# Altium project FMC_AWG_Common.PrjPCB (part 2 of 5)

## Sheet FMC_AWG_DAC_PSU_LDO.SchDoc: FMC DAC 1.5GS 4CH
size 420 x 297 mm; Author: G.Kasprowicz; CompanyName: WUT ISE; DrawnBy: G.Kasprowicz; Organization: WUT ISE; Address1: PW ISE; Address2: Nowowiejska 15/19 00-665 Warsaw; Address3: gkasprow@gmail.com; DocumentNumber: 10; Revision: 1; SheetNumber: 10; SheetTotal: 12; ModifiedBy: -; CheckedDate: -; Title2: Power supply; DivGrp: WUT ISE; Designer: G.Kasprowicz; ModifiedDate: -; ProjectName: Sensor Box
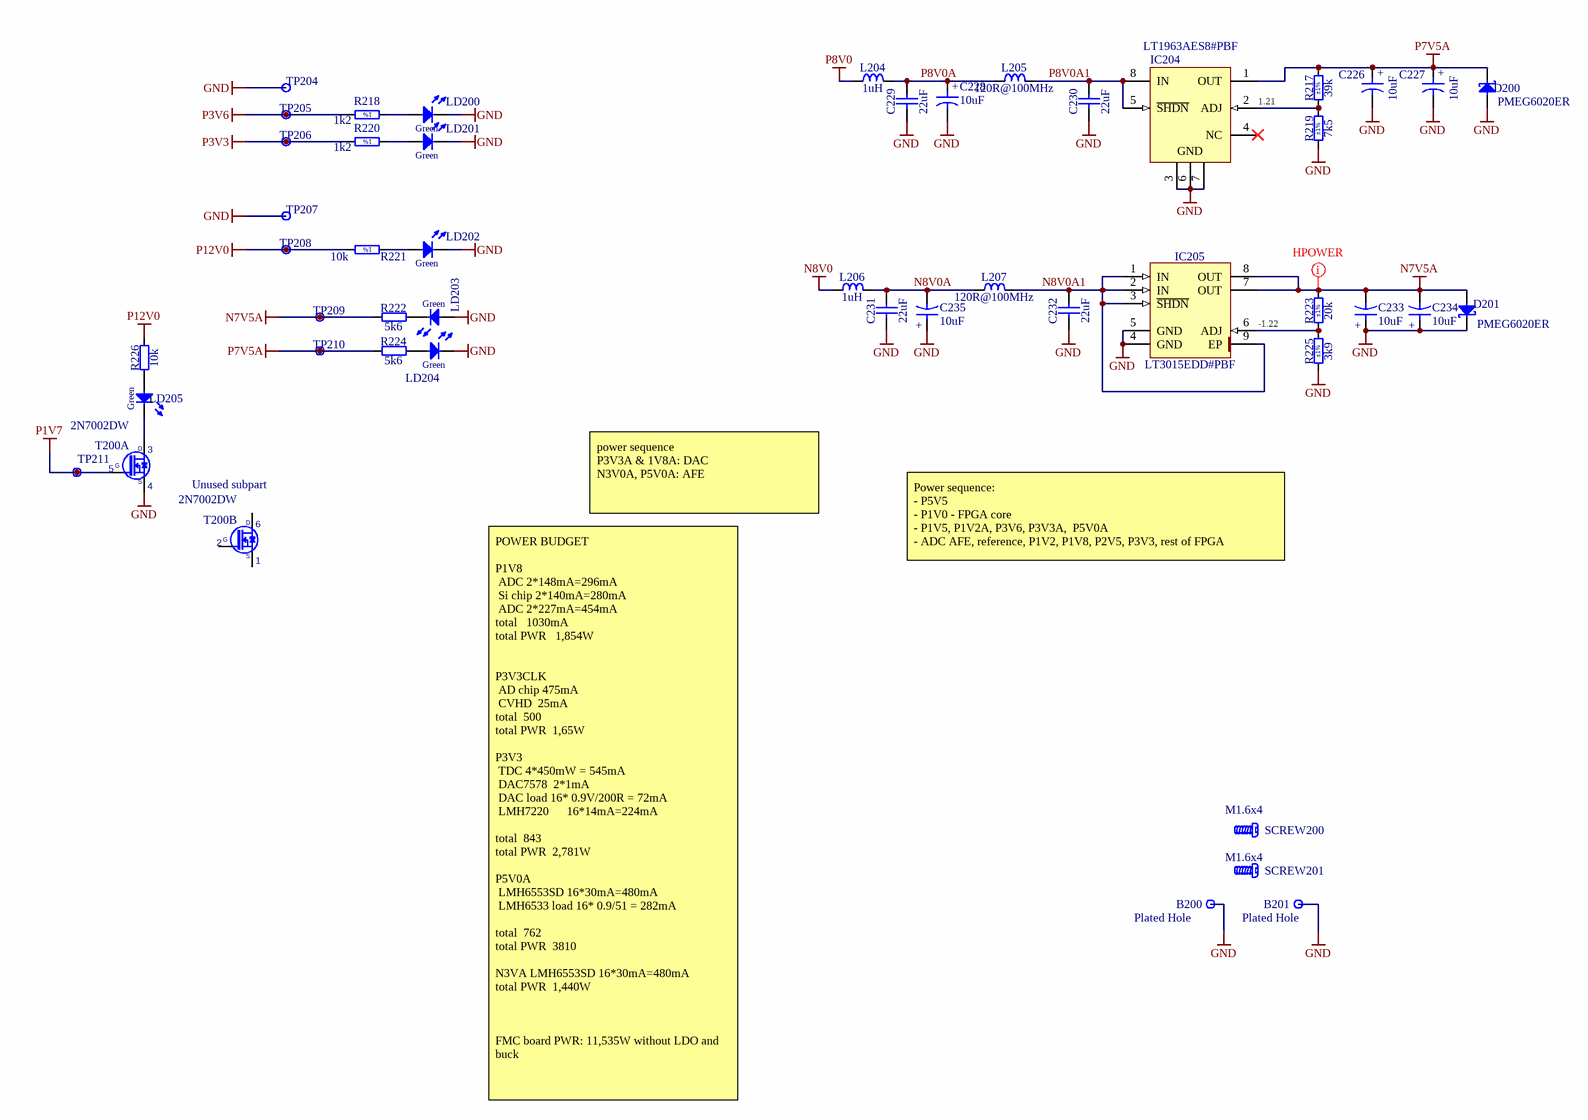
[diagram p2: FMC_AWG_DAC_PSU_LDO.SchDoc]

### Parts
B200  Plated Hole  [c300h160]  (no BOM)
B201  Plated Hole  [c300h160]  (no BOM)
C226  10uF  [CAPMP3216X180N]
C227  10uF  [CAPMP3216X180N]
C228  10uF  [CAPMP3216X180N]
C229  22uF  [CAPC2012X135N]
C230  22uF  [CAPC2012X135N]
C231  22uF  [CAPC2012X135N]
C232  22uF  [CAPC2012X135N]
C233  10uF  [CAPMP3216X180N]
C234  10uF  [CAPMP3216X180N]
C235  10uF  [CAPMP3216X180N]
D200  PMEG6020ER  [SODFL3517X110N]
D201  PMEG6020ER  [SODFL3517X110N]
IC204  LT1963AES8#PBF  [LT-S8-8_L]
IC205  LT3015EDD#PBF  [SON50P300X300X80-9N-R175X248]
L204  1uH  [INDC2620X100N]
L205  120R@100MHz  [INDC1608X65N]
L206  1uH  [INDC2620X100N]
L207  120R@100MHz  [INDC1608X65N]
LD200  Green  [LED_KINGBRIGHT_KPH-1608CGCKr]  (value not drawn)
LD201  Green  [LED_KINGBRIGHT_KPH-1608CGCKr]  (value not drawn)
LD202  Green  [LED_KINGBRIGHT_KPH-1608CGCKr]  (value not drawn)
LD203  Green  [LED_KINGBRIGHT_KPH-1608CGCK]
LD204  Green  [LED_KINGBRIGHT_KPH-1608CGCK]
LD205  Green  [LED_KINGBRIGHT_KPH-1608CGCK]
R217  39k  Tolerance: ±1%  [RESC1005X40N]
R218  1k2  [RESC1608X55N]
R219  7k5  Tolerance: ±1%  [RESC1005X40N]
R220  1k2  [RESC1608X55N]
R221  10k  [RESC1005X40N]
R222  5k6  [RESC1005X40N]
R223  20k  Tolerance: ±1%  [RESC1005X40N]
R224  5k6  [RESC1005X40N]
R225  3k9  Tolerance: ±1%  [RESC1005X40N]
R226  10k  [RESC1005X40N]
SCREW200  M1.6x4  [BOSSARD_B1.6X4/BN660_v]
SCREW201  M1.6x4  [BOSSARD_B1.6X4/BN660_v]
T200  2N7002DW  [SOT65P210X110-6N]  (parts A,B of 2)
TP204  Test Point  [TPS127]  (value not drawn)  (no BOM)
TP205  Test Point  [TPS127]  (value not drawn)  (no BOM)
TP206  Test Point  [TPS127]  (value not drawn)  (no BOM)
TP207  Test Point  [TPS127]  (value not drawn)  (no BOM)
TP208  Test Point  [TPS127]  (value not drawn)  (no BOM)
TP209  Test Point  [TPS127]  (value not drawn)  (no BOM)
TP210  Test Point  [TPS127]  (value not drawn)  (no BOM)
TP211  Test Point  [TPS127]  (value not drawn)  (no BOM)

### Nets
GND: B200.1 B201.1 C226.2 C227.2 C228.2 C229.1 C230.1 C231.1 C232.1 C233.1 C234.1 C235.1 D200.2(A) D201.1(C) IC204.3(GND) IC204.6(GND) IC204.7(GND) IC205.4(GND) IC205.5(GND) LD200.1(C) LD201.1(C) LD202.1(C) LD203.2(A) LD204.1(C) R219.1 R225.1 T200.4(S1) TP204.1 TP207.1
N7V5A: C233.2 C234.2 D201.2(A) IC205.7(OUT) IC205.8(OUT) R222.1 R223.2 TP209.1
N8V0: L206.1
P1V7: T200.5(G1) TP211.1
P3V3: R220.2 TP206.1
P3V6: R218.2 TP205.1
P7V5A: C226.1 C227.1 D200.1(C) IC204.1(OUT) R217.2 R224.1 TP210.1
P8V0: L204.1
P12V0: R221.2 R226.2 TP208.1
N8V0A: C231.2 C235.2 L206.2 L207.1
N8V0A1: C232.2 IC205.1(IN) IC205.2(IN) IC205.3(~{SHDN}) IC205.9(EP) L207.2
P8V0A: C228.1 C229.2 L204.2 L205.1
P8V0A1: C230.2 IC204.5(~{SHDN}) IC204.8(IN) L205.2
NetIC204_2: IC204.2(ADJ) R217.1 R219.2
NetIC205_6: IC205.6(ADJ) R223.1 R225.2
NetLD200_2: LD200.2(A) R218.1
NetLD201_2: LD201.2(A) R220.1
NetLD202_2: LD202.2(A) R221.1
NetLD203_1: LD203.1(C) R222.2
NetLD204_2: LD204.2(A) R224.2
NetLD205_1: LD205.1(C) T200.3(D1)
NetLD205_2: LD205.2(A) R226.1

Not connected (* = marked no-connect by the designer): IC204 4(NC)*; T200 1(S2) 2(G2) 6(D2)

### Layout directives
net class Hpower: N7V5A

### Notes on the sheet
- 1.21
- -1.22
- (near T200) Unused subpart
- power sequence
  P3V3A & 1V8A: DAC
  N3V0A, P5V0A: AFE
- Power sequence:
  - P5V5
  - P1V0 - FPGA core
  - P1V5, P1V2A, P3V6, P3V3A,  P5V0A
  - ADC AFE, reference, P1V2, P1V8, P2V5, P3V3, rest of FPGA
- POWER BUDGET
  P1V8
  ADC	2*148mA=296mA
  Si chip	2*140mA=280mA
  ADC	2*227mA=454mA
  total			1030mA
  total PWR			1,854W
  P3V3CLK
  AD chip	475mA
  CVHD 	25mA
  total		500
  total PWR		1,65W
  P3V3
  TDC	4*450mW = 545mA
  DAC7578	 2*1mA
  DAC load	16* 0.9V/200R = 72mA
  LMH7220	     16*14mA=224mA
  total		843
  total PWR		2,781W
  P5V0A
  LMH6553SD 16*30mA=480mA
  LMH6533 load 16* 0.9/51 = 282mA
  total		762
  total PWR		3810
  N3VA	LMH6553SD 16*30mA=480mA
  total PWR		1,440W
  FMC board PWR: 11,535W without LDO and buck
- Project/Equipment
- Document
- Designer
- Drawn by
- Check.by
- Copyright WUT ISE 2018.
  This documentation describes Open Hardware and is licensed under the CERN OHL v.1.1. You may redistribute and modify this documentation under the terms of the CERN OHL v.1.1. (http://ohwr.org/CERNOHL). This documentation is distributed WITHOUT ANY EXPRESS OR IMPLIED WARRANTY, INCLUDING OF MERCHANTABILITY, SATISFACTORY QUALITY AND FITNESS FOR A PARTICULAR PURPOSE. Please see the CERN OHL v.1.1 for applicable conditions.
- Contact
- File
- Last Mod.
- Print Date
- Sheet
- Size
- A3
- of
- Rev
- (in symbol 2N7002DW, part A) D; G; S
- (in symbol 2N7002DW, part B) D; G; S
- (in symbol CTE3216-18_10UF_16V_20%_AVX_TCJ) +
- (in symbol R0402_10K_1%_0.0625W_100PPM) 1%
- (in symbol R0603_1K2_1%_0.1W_100PPM) 1%

### Library data of the parts
B200 B201 = PLATED_HOLE1.6_PAD3.0: Single Terminal Socket; Part Description: Plated Through Hole: Hole Dia.=1.6mm Pad Dia.=3.0mm; Mounted: No; Part Number: PLATED_HOLE1.6_PAD3.0; Component Type: Standard (No BOM); Pin Count: 1; Family: Plated Hole; Socket: No; SMD: No; Sense: No; Status: None; ComponentHeight: 0mm; HelpURL: Undefined; Author: CERN DEM JMW; CreateDate: 05.11.2009; LatestRevisionDate: 05.11.2009; PackageDescription: Plated Through Hole: Hole Dia.=1.6mm Pad Dia.=3.0mm
C226-C228 C233-C235 = CTE3216-18_10UF_16V_20%_AVX_TCJ: Polarised capacitor; Part Description: ESR 0R200 Tantalum Solid Electrolytic Chip Capacitor with Conductive Polymer Electrode; Manufacturer: AVX; Manufacturer Part Number: TCJA106M016R0200; Voltage: 16V; Tolerance: ±20%; Part Number: CTE3216-18_10UF_16V_20%_AVX_TCJ; Component Kind: Standard; Component Type: Standard; Pin Count: 2; Value: 10uF; Status: Preferred; Case: A; Mounted: Yes; Socket: No; SMD: Yes; Sense: No; ComponentHeight: 1.8mm; HelpURL: \\cern.ch\dfs\Applications\Altium\Datasheets\CTE_AVX_TCJ.pdf; Author: CERN DEM JLC; CreateDate: 29.03.2012; LatestRevisionDate: 29.03.2012
C229-C232 = CC0805_22UF_16V_10%_X5R: Non-polarised capacitor; Part Description: SMD Multilayer Chip Ceramic Capacitor; Manufacturer: GENERIC; Manufacturer1 Part Number: C2012X5R1C226KT; Voltage: 16V; TC: X5R; Tolerance: ±10%; Part Number: CC0805_22UF_16V_10%_X5R; Component Kind: Standard; Component Type: Standard; Pin Count: 2; Value: 22uF; Status: Preferred; Manufacturer Part Number: CC0805_22UF_16V_10%_X5R; Case: 0805; Mounted: Yes; Socket: No; SMD: Yes; Sense: No; Manufacturer1 Example: TDK; Manufacturer1 ComponentHeight: 1.35mm; HelpURL: \\cern.ch\dfs\Applications\Altium\Datasheets\CC0805_X5R_TDK_C.pdf; Author: CERN DEM JLC; CreateDate: 25.10.2012; LatestRevisionDate: 25.10.2012
D200 D201 = PMEG6020ER: Schottky Diode; Part Description: MEGA Schottky Barrier Rectifier; Manufacturer: NXP SEMICONDUCTORS; Voltage: 60V; Power: 2A; PressFit: No; Bonding: No; Part Number: PMEG6020ER; Component Kind: Standard; Component Type: Standard; Device: PMEG6020ER; PackageDescription: SODFL Diode (SOD123W); 2.60mm W X 1.70mm L X 1.10mm H body, IPC Medium Density; Manufacturer Part Number: PMEG6020ER; Pin Count: 2; Case: SOD123; Mounted: Yes; Socket: No; SMD: Yes; Sense: No; ComponentHeight: 0.65mm; HelpURL: \\cern.ch\dfs\Applications\Altium\Datasheets\PMEG6020ER.pdf; Author: CERN DEM JMW; CreateDate: 19.06.2014; LatestRevisionDate: 19.06.2014
IC204 = CMP-0476-01595-1: 1.5 A, Low Noise, Fast Transient Response LDO Regulator, 2.1 to 20 V Vin, Adjustable Vout, 8-pin SOIC (S8-8), -40 to 125 degC, Pb-Free; Manufacturer: Linear Technology; Isupply(mA): 1; Shutdown Current(uA): 0.01; PSRR(dB): 63; Vin Min(V): 2.1; Vout Max(V): 20; Vout Min(V): 1.21; Iout(mA): 1500; Noise(uV): 40; Output Voltage: Adj; Dropout Voltage(V): 0.34; Discrete Pass Element: no; PackageVersion: Rev. G, 03/2012; Mounting Technology: Surface Mount; Number of Outputs: 1; RoHS: TRUE; ComponentLink1URL: http://www.linear.com/; PackageReference: S8-8; Vin Max(V): 20; ComponentLink2URL: http://cds.linear.com/docs/en/datasheet/1963afe.pdf; PackageDescription: 8-Pin Plastic Small Outline (Narrow .150 Inch), Body 4.9 x 3.9 mm, Pitch 1.27 mm; ComponentLink1Description: Manufacturer URL; ComponentLink2Description: Datasheet; ComponentLink3URL: http://cds.linear.com/docs/en/packaging/05081610_G_SO8.pdf; ComponentLink3Description: Package Specification; PartNumber: LT1963AES8#PBF; DatasheetVersion: Rev. E
IC205 = LT3015EDD#PBF: 1.5A, Low Noise, Negative Linear Regulator with Precision Current Limit; Part Description: –1.22V to –29.3V, 1.5A, Low Noise, Negative Linear Regulator with Precision Current Limit; Manufacturer: LINEAR TECHNOLOGY; PressFit: No; Bonding: No; Part Number: LT3015EDD#PBF; Component Kind: Standard; Component Type: Standard; Device: LT3015EDD#PBF; PackageDescription: SON, (DFN) 0.50mm,pitch; 8 pin,3.00mm W X 3.00mm L X 0.80mm H body (w/thermal tab 1.75 X2.48mm), IPC Medium Density; Manufacturer Part Number: LT3015EDD#PBF; Pin Count: 9; Case: SON8; Mounted: Yes; Socket: No; SMD: Yes; Sense: No; ComponentHeight: 0.8mm; HelpURL: \\cern.ch\dfs\Applications\Altium\Datasheets\LT3015EDD#PBF.pdf; Author: CERN DEM MR; CreateDate: 10.02.2016; LatestRevisionDate: 10.02.2016
L204 L206 = IND1008_1UH_20%_WURTH_74479787210B: Inductor; Part Description: Power Multilayer Inductor (WE-PMI Series); Manufacturer: WURTH ELEKTRONIK; Power: 1.95A; Resistance: 0.06R; Tolerance: ±20%; Part Number: IND1008_1UH_20%_WURTH_74479787210B; Component Kind: Standard; Component Type: Standard; Pin Count: 2; Value: 1uH; Status: None; Manufacturer Part Number: 74479787210B; Mounted: Yes; Socket: No; SMD: Yes; Sense: No; ComponentHeight: 1mm; HelpURL: \\cern.ch\dfs\Applications\Altium\Datasheets\IND_WURTH_WE-PMI_74479787210B.pdf; Author: CERN DEM JLC; CreateDate: 01.10.2014; LatestRevisionDate: 01.10.2014; Case: 1008
L205 L207 = IND0603_MURATA_BLM18SG121TN1D: Inductor; Part Description: SMD EMIFIL Suppression Chip Ferrite Bead; Manufacturer: MURATA; Power: 3A; Resistance: 0.025R; Tolerance: ±25%; Part Number: IND0603_MURATA_BLM18SG121TN1D; Component Kind: Standard; Component Type: Standard; Pin Count: 2; Value: 120R@100MHz; Status: None; Manufacturer Part Number: BLM18SG121TN1D; Case: 0603; Mounted: Yes; Socket: No; SMD: Yes; Sense: No; ComponentHeight: 0.65mm; HelpURL: \\cern.ch\dfs\Applications\Altium\Datasheets\IND0603_MURATA_BLM18S.pdf; Author: CERN DEM JLC; CreateDate: 23.07.2014; LatestRevisionDate: 23.07.2014
LD200-LD202 = LED_0603_Green: Green 0603; Part Number: LED_KINGBRIGHT_KPH-1608CGCK; Part Description: SMD Green LED, Case 1.6mmX0.8mm(0603), 0.65mm Thickness; Manufacturer: KINGBRIGHT; Manufacturer Part Number: KPH-1608CGCK; PressFit: No; Bonding: No; Component Kind: Standard; Component Type: Standard; Color: Green; Footprint: LED_KINGBRIGHT_KPH-1608CGCK; PackageDescription: SMT Green LED, Case 0603, Body L 1.6 x W 0.8mm H 0.65mm; Pin Count: 2; Mounted: Yes; Socket: No; SMD: Yes; Sense: No; ComponentHeight: 0.65mm; HelpURL: \\cern.ch\dfs\Applications\Altium\Datasheets\LED_KINGBRIGHT_KPH-1608CGCK.pdf; Author: CERN DEM JLC; CreateDate: 03.07.2017; LatestRevisionDate: 03.07.2017
LD203-LD205 = LED_KINGBRIGHT_KPH-1608CGCK: LED Green 1C 2A; Part Description: SMD Green LED, Case 1.6mmX0.8mm(0603), 0.65mm Thickness; PressFit: No; Bonding: No; Part Number: LED_KINGBRIGHT_KPH-1608CGCK; Component Kind: Standard; Component Type: Standard; Color: Green; PackageDescription: SMT Green LED, Case 0603, Body L 1.6 x W 0.8mm H 0.65mm; Manufacturer: KINGBRIGHT; Manufacturer Part Number: KPH-1608CGCK; Pin Count: 2; Mounted: Yes; Socket: No; SMD: Yes; Sense: No; ComponentHeight: 0.65mm; HelpURL: \\cern.ch\dfs\Applications\Altium\Datasheets\LED_KINGBRIGHT_KPH-1608CGCK.pdf; Author: CERN DEM JLC; CreateDate: 03.07.2017; LatestRevisionDate: 03.07.2017
R217 = R0402_39K_1%_0.0625W_100PPM: Resistor - 1%; Part Description: General Purpose Thick Film Chip Resistor; Manufacturer: GENERIC; Manufacturer1 Part Number: 232270673903; TC: ±100ppm/°C; PressFit: No; Part Number: R0402_39K_1%_0.0625W_100PPM; Component Kind: Standard; Component Type: Standard; Pin Count: 2; Value: 39k; Status: Not Recommended; Power: 0.0625W; Manufacturer Part Number: R0402_39K_1%_0.0625W_100PPM; Case: 0402; Mounted: Yes; Sense: No; Socket: No; SMD: Yes; Manufacturer1 Example: YAGEO PHYCOMP; Manufacturer1 ComponentHeight: 0.4mm; HelpURL: \\cern.ch\dfs\Applications\Altium\Datasheets\R0402_Phycomp_RC0402.pdf; Author: CERN DEM JLC; CreateDate: 03.12.2007; LatestRevisionDate: 17.10.2012
R218 R220 = R0603_1K2_1%_0.1W_100PPM: Resistor - 1%; Part Description: General Purpose Thick Film Chip Resistor; Manufacturer: GENERIC; Manufacturer1 Part Number: NRC06F1201TRF; Power: 0.1W; TC: ±100ppm/°C; Part Number: R0603_1K2_1%_0.1W_100PPM; Component Kind: Standard; Component Type: Standard; Pin Count: 2; Value: 1k2; Status: Preferred; Tolerance: ±1%; Manufacturer Part Number: R0603_1K2_1%_0.1W_100PPM; Case: 0603; Mounted: Yes; Sense: No; Socket: No; SMD: Yes; Manufacturer1 Example: NIC COMPONENT; Manufacturer1 ComponentHeight: 0.55mm; HelpURL: \\cern.ch\dfs\Applications\Altium\Datasheets\R0603_NIC_NRC.pdf; Author: CERN DEM JLC; CreateDate: 03.12.2007; LatestRevisionDate: 13.03.2008
R219 = R0402_7K5_1%_0.0625W_100PPM: Resistor - 1%; Part Description: General Purpose Thick Film Chip Resistor; Manufacturer: GENERIC; Manufacturer1 Part Number: 232270677502L; TC: ±100ppm/°C; PressFit: No; Part Number: R0402_7K5_1%_0.0625W_100PPM; Component Kind: Standard; Component Type: Standard; Pin Count: 2; Value: 7k5; Status: Not Recommended; Power: 0.0625W; Manufacturer Part Number: R0402_7K5_1%_0.0625W_100PPM; Case: 0402; Mounted: Yes; Sense: No; Socket: No; SMD: Yes; Manufacturer1 Example: YAGEO PHYCOMP; Manufacturer1 ComponentHeight: 0.4mm; HelpURL: \\cern.ch\dfs\Applications\Altium\Datasheets\R0402_Phycomp_RC0402.pdf; Author: CERN DEM JLC; CreateDate: 03.12.2007; LatestRevisionDate: 17.10.2012
R221 = R0402_10K_1%_0.0625W_100PPM: Resistor - 1%; Part Description: General Purpose Thick Film Chip Resistor; Manufacturer: GENERIC; Manufacturer1 Part Number: 232270671003L; TC: ±100ppm/°C; Part Number: R0402_10K_1%_0.0625W_100PPM; Component Kind: Standard; Component Type: Standard; Pin Count: 2; Value: 10k; Status: Not recommended; Power: 0.0625W; Tolerance: ±1%; Manufacturer Part Number: R0402_10K_1%_0.0625W_100PPM; Case: 0402; Mounted: Yes; Sense: No; Socket: No; SMD: Yes; Manufacturer1 Example: YAGEO PHYCOMP; Manufacturer1 ComponentHeight: 0.4mm; HelpURL: \\cern.ch\dfs\Applications\Altium\Datasheets\R0402_Phycomp_RC0402.pdf; Author: CERN DEM JLC; CreateDate: 03.12.2007; LatestRevisionDate: 17.10.2012
R222 R224 = R0402_5k6_1%_0.0625W_100PPM: Resistor - 1%; Part Description: General Purpose Thick Film Chip Resistor; Manufacturer: GENERIC; Manufacturer1 Part Number: 232270675602L; TC: ±100ppm/°C; PressFit: No; Part Number: R0402_5K6_1%_0.0625W_100PPM; Component Kind: Standard; Component Type: Standard; Pin Count: 2; Value: 5k6; Status: Not Recommended; Power: 0.0625W; Tolerance: ±1%; Manufacturer Part Number: R0402_5K6_1%_0.0625W_100PPM; Case: 0402; Mounted: Yes; Sense: No; Socket: No; SMD: Yes; Manufacturer1 Example: YAGEO PHYCOMP; Manufacturer1 ComponentHeight: 0.4mm; HelpURL: \\cern.ch\dfs\Applications\Altium\Datasheets\R0402_Phycomp_RC0402.pdf; Author: CERN DEM JLC; CreateDate: 03.12.2007; LatestRevisionDate: 17.10.2012
R223 = R0402_20K_1%_0.0625W_100PPM: Resistor - 1%; Part Description: General Purpose Thick Film Chip Resistor; Manufacturer: GENERIC; Manufacturer1 Part Number: 232270672003L; TC: ±100ppm/°C; PressFit: No; Part Number: R0402_20K_1%_0.0625W_100PPM; Component Kind: Standard; Component Type: Standard; Pin Count: 2; Value: 20k; Status: Not Recommended; Power: 0.0625W; Manufacturer Part Number: R0402_20K_1%_0.0625W_100PPM; Case: 0402; Mounted: Yes; Sense: No; Socket: No; SMD: Yes; Manufacturer1 Example: YAGEO PHYCOMP; Manufacturer1 ComponentHeight: 0.4mm; HelpURL: \\cern.ch\dfs\Applications\Altium\Datasheets\R0402_Phycomp_RC0402.pdf; Author: CERN DEM JLC; CreateDate: 03.12.2007; LatestRevisionDate: 17.10.2012
R225 = R0402_3K9_1%_0.0625W_100PPM: Resistor - 1%; Part Description: General Purpose Thick Film Chip Resistor; Manufacturer: GENERIC; Manufacturer1 Part Number: 232270673902L; TC: ±100ppm/°C; PressFit: No; Part Number: R0402_3K9_1%_0.0625W_100PPM; Component Kind: Standard; Component Type: Standard; Pin Count: 2; Value: 3k9; Status: Not Recommended; Power: 0.0625W; Manufacturer Part Number: R0402_3K9_1%_0.0625W_100PPM; Case: 0402; Mounted: Yes; Sense: No; Socket: No; SMD: Yes; Manufacturer1 Example: YAGEO PHYCOMP; Manufacturer1 ComponentHeight: 0.4mm; HelpURL: \\cern.ch\dfs\Applications\Altium\Datasheets\R0402_Phycomp_RC0402.pdf; Author: CERN DEM JLC; CreateDate: 03.12.2007; LatestRevisionDate: 17.10.2012
R226 = R0402_10K_1%_0.0625W_100PPM: Resistor - 1%; Part Description: General Purpose Thick Film Chip Resistor; Manufacturer: GENERIC; Manufacturer1 Part Number: 232270671003L; TC: ±100ppm/°C; PressFit: No; Part Number: R0402_10K_1%_0.0625W_100PPM; Component Kind: Standard; Component Type: Standard; Pin Count: 2; Value: 10k; Status: Not Recommended; Power: 0.0625W; Tolerance: ±1%; Manufacturer Part Number: R0402_10K_1%_0.0625W_100PPM; Case: 0402; Mounted: Yes; Sense: No; Socket: No; SMD: Yes; Manufacturer1 Example: YAGEO PHYCOMP; Manufacturer1 ComponentHeight: 0.4mm; HelpURL: \\cern.ch\dfs\Applications\Altium\Datasheets\R0402_Phycomp_RC0402.pdf; Author: CERN DEM JLC; CreateDate: 03.12.2007; LatestRevisionDate: 17.10.2012
SCREW200 SCREW201 = MECH_SCREW_M1.6x4: Screw; Part Number: BOSSARD_B1.6X4/BN660; Part Description: M1.6 L=4mm Philips Head Machine Screw, DIN 7985A, Stainless Steel A2; Manufacturer: BOSSARD; Manufacturer Part Number: B1.6X4/BN660; PressFit: No; Component Kind: Standard; Component Type: Mechanical; Pin Count: 0; PackageDescription: M1.6 L=4mm Philips Head Machine Screw, DIN 7985A, Stainless Steel A2; Mounted: Yes; Socket: No; SMD: No; Sense: No; Status: None; Value: M1.6x4; ComponentHeight: 1mm; HelpURL: \\cern.ch\dfs\Applications\Altium\Datasheets\BOSSARD_BN650-1243721.pdf; Author: GK; CreateDate: 04.12.2015; LatestRevisionDate: 04.12.2015
T200 = 2N7002DW: 60 V, 115 mA, Dual N-Channel Field Effect Transistor, Enhancement Mode; Part Description: 60V 115mA Dual N-Channel Field Effect Transistor, Enhancement Mode; Manufacturer: ON SEMICONDUCTOR; PressFit: No; Bonding: No; Part Number: 2N7002DW; Component Kind: Standard; Component Type: Standard; Device: 2N7002DW; PackageDescription: SOT363, SC70-6, 0.65mm Pitch; 6 Pin, 1.25mm W X 2.00mm L X 1.10mm H body, IPC Medium Density; Manufacturer Part Number: 2N7002DW; Pin Count: 6; Case: SOT363; Mounted: Yes; Socket: No; SMD: Yes; Sense: No; ComponentHeight: 1.1mm; HelpURL: \\cern.ch\dfs\Applications\Altium\Datasheets\2N7002DW.pdf; Author: CERN DEM BC; CreateDate: 25.11.2020; LatestRevisionDate: 25.11.2020
TP204-TP211 = SMD_PAD_1.27X1.27MM: Part Description: 1.27mm x 1.27mm PCB Copper Area (SMD Test Point); Mounted: No; Part Number: SMD_PAD_1.27X1.27MM; Component Type: Standard (No BOM); Pin Count: 1; Family: Test Point; Socket: No; SMD: Yes; Sense: No; Status: None; ComponentHeight: 0mm; HelpURL: Undefined; Author: CERN DEM JLC; CreateDate: 12.01.2008; LatestRevisionDate: 12.01.2008; PackageDescription: 1.27mm x 1.27mm PCB Copper Area (SMD Test Point)

## Sheet FMC_DAC_1_5GS_4CH.schdoc: FMC DAC 1.5GS 4CH
size 420 x 297 mm; EDA_Number: ARTIQ; Projet: ARTIQ/SINARA; Author: G.Kasprowicz; CompanyName: WUT ISE; DrawnBy: G.Kasprowicz; Organization: WUT ISE; Address1: PW ISE; Address2: Nowowiejska 15/19 00-665 Warsaw; Address3: gkasprow@gmail.com; DocumentNumber: 1; Revision: 1; SheetNumber: 1; SheetTotal: 18; ModifiedBy: -; CheckedDate: -; Title2: Top; DivGrp: WUT ISE; Designer: G.Kasprowicz; ModifiedDate: -; ProjectName: Sensor Box
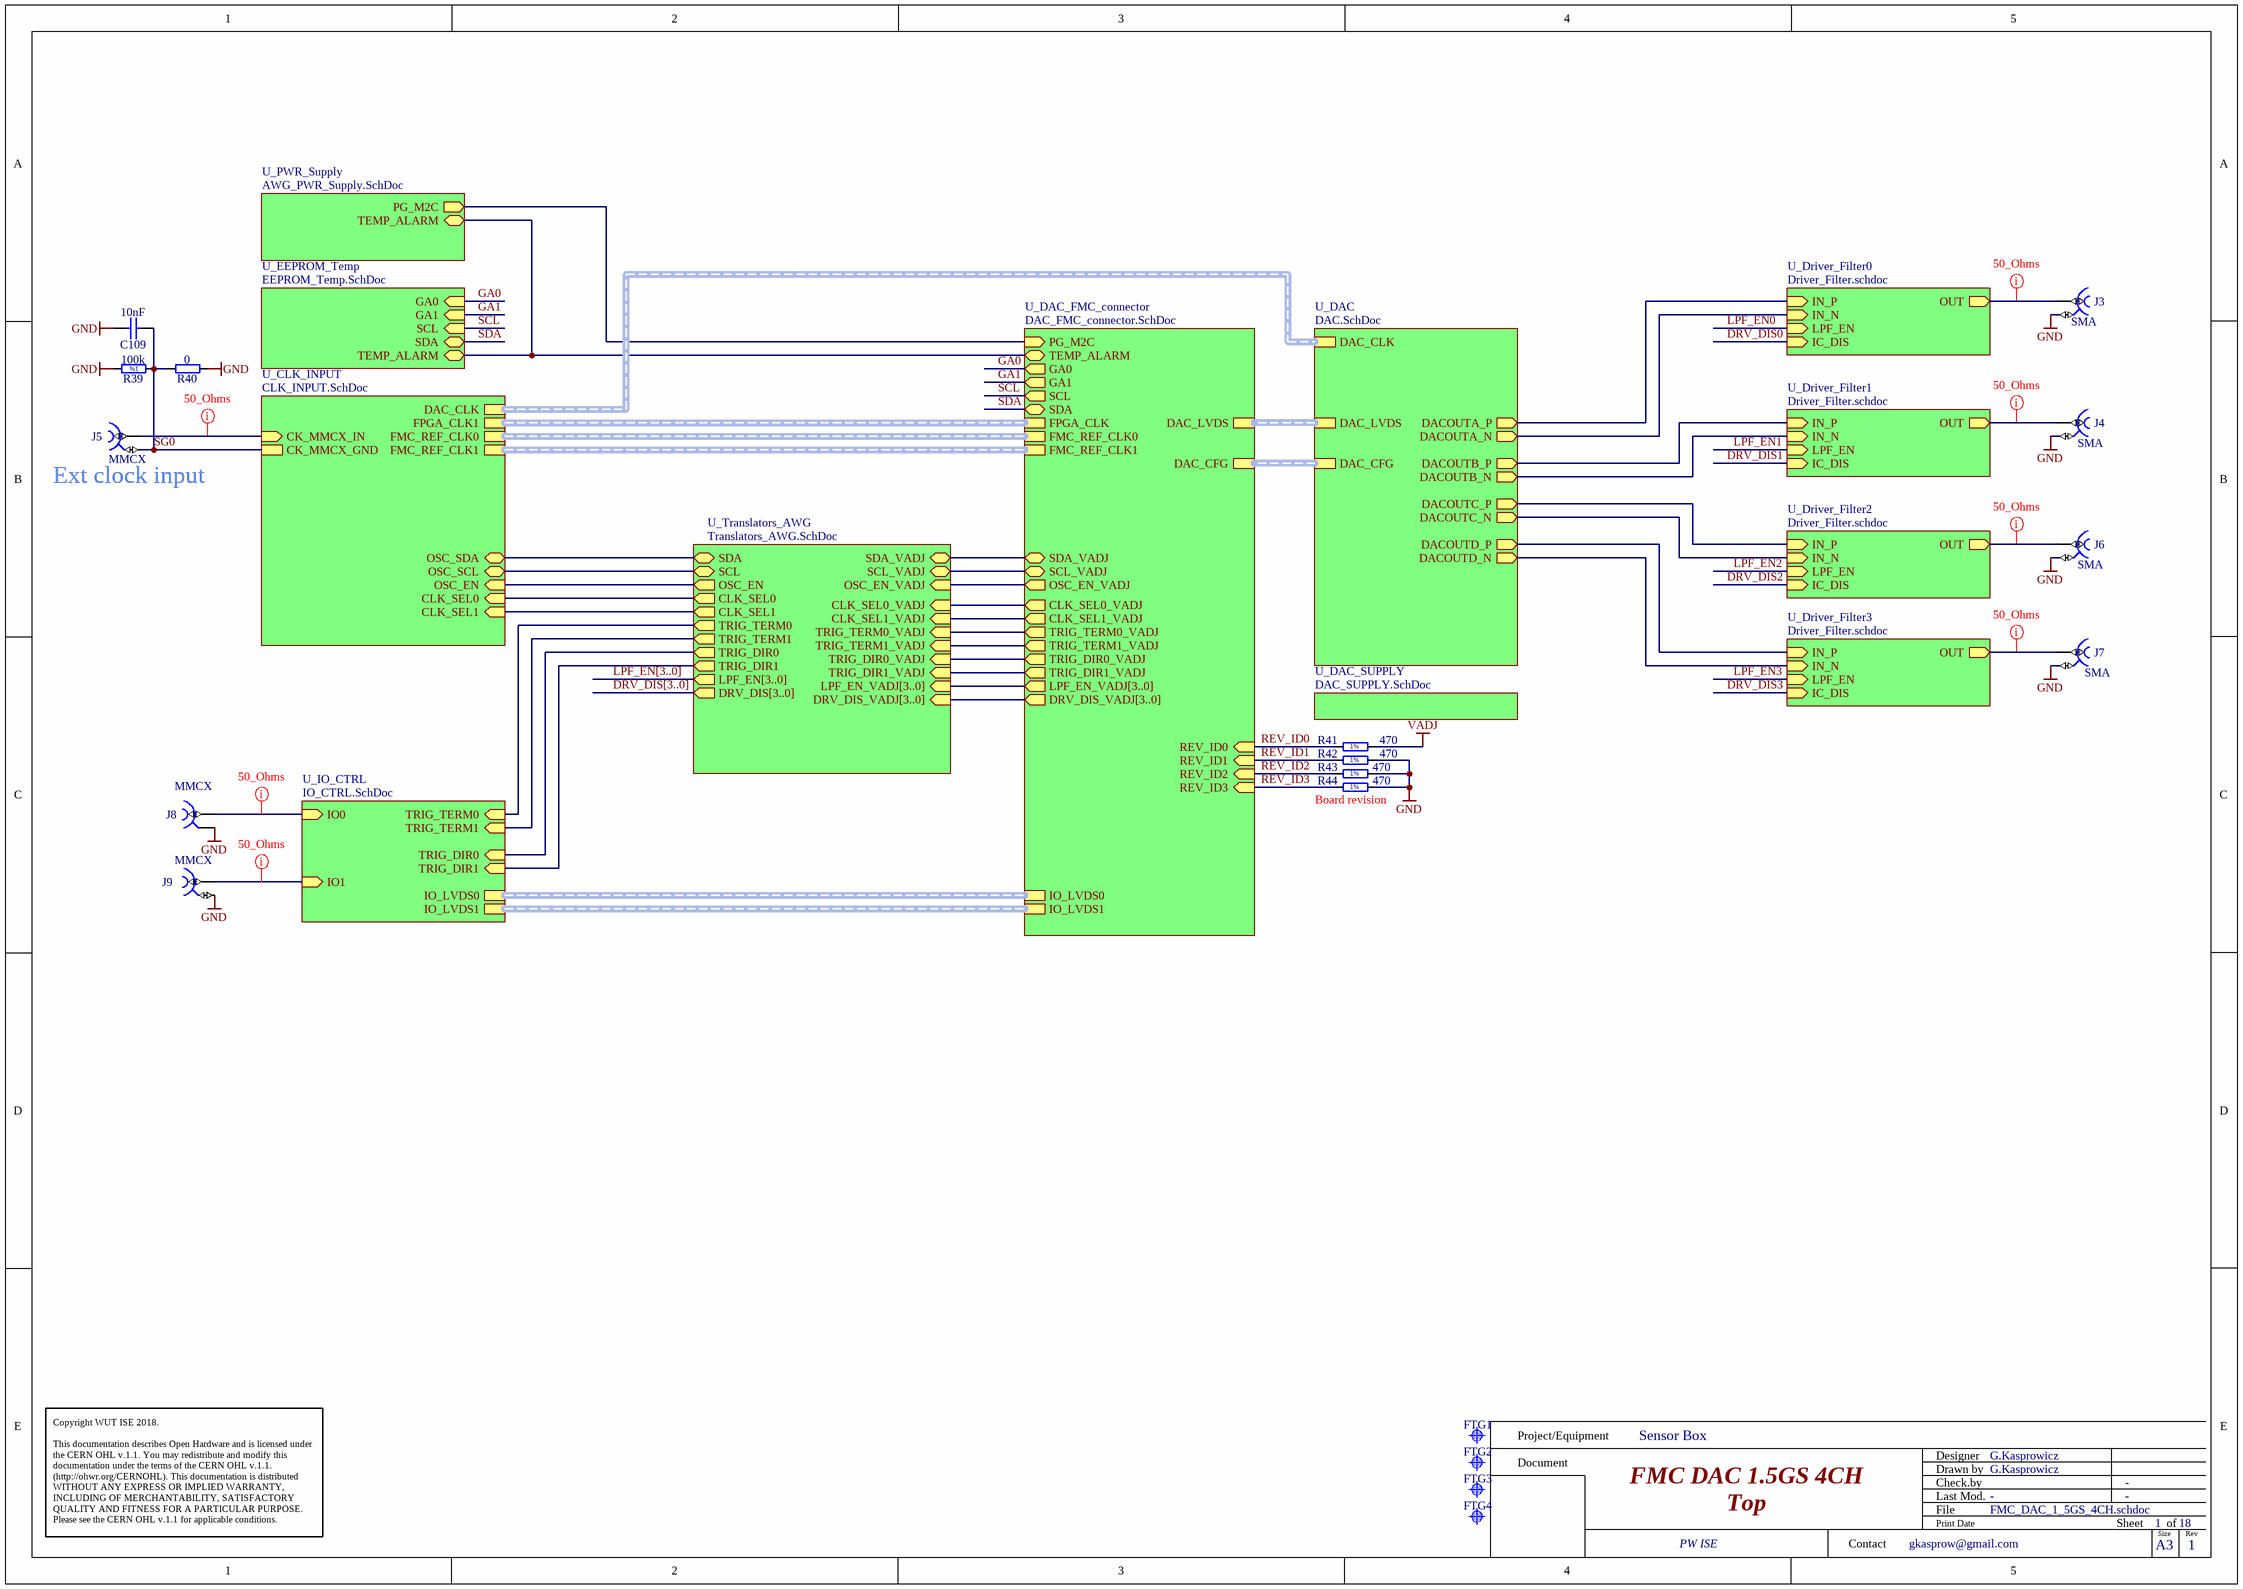
[diagram p3: FMC_DAC_1_5GS_4CH.schdoc]

### Parts
C109  10nF  [CAPC1005X55N]
FTG1  Use only in PCB  [FIDUCIAL_TOP_C100-200]  (value not drawn)  (no BOM)
FTG2  Use only in PCB  [FIDUCIAL_TOP_S100-200]  (value not drawn)  (no BOM)
FTG3  Use only in PCB  [FIDUCIAL_TOP_S100-200]  (value not drawn)  (no BOM)
FTG4  Use only in PCB  [FIDUCIAL_TOP_S100-200]  (value not drawn)  (no BOM)
J3  SMA  [AMPHENOL_901-143]
J4  SMA  [AMPHENOL_901-143]
J5  Family: MMCX  [HUBER-SUHNER_85_MMCX-50-0-1/111 OH]  (hidden comment: Coax_1Female_1Shield)
J6  SMA  [AMPHENOL_901-143]
J7  SMA  [AMPHENOL_901-143]
J8  Family: MMCX  [HUBER-SUHNER_85_MMCX-50-0-1/111 OH]  (hidden comment: Coax_1Female_1Shield)
J9  Family: MMCX  [HUBER-SUHNER_85_MMCX-50-0-1/111 OH]  (hidden comment: Coax_1Female_1Shield)
R39  100k  [RESC1005X40N]
R40  0  [RESC1608X55N]
R41  470  [RESC1005X40N]
R42  470  [RESC1005X40N]
R43  470  [RESC1005X40N]
R44  470  [RESC1005X40N]

### Sub-sheets
U_CLK_INPUT = CLK_INPUT.SchDoc: DAC_CLK (harness CLKDIFF), OSC_EN (in), OSC_SCL (bidir), OSC_SDA (bidir), CK_MMCX_GND, CK_MMCX_IN (in), FPGA_CLK1 (harness CLKDIFF), FMC_REF_CLK0 (harness DIFFCLK), CLK_SEL1 (in), FMC_REF_CLK1 (harness DIFFCLK), CLK_SEL0 (in)
U_DAC = DAC.SchDoc: DAC_CFG (harness DAC_CFG), DAC_LVDS (harness DAC_LVDS), DAC_CLK (harness CLKDIFF), DACOUTA_P (out), DACOUTA_N (out), DACOUTB_N (out), DACOUTB_P (out), DACOUTC_P (out), DACOUTC_N (out), DACOUTD_N (out), DACOUTD_P (out)
U_DAC_FMC_connector = DAC_FMC_connector.SchDoc: GA0 (out), GA1 (out), SCL (out), DAC_LVDS (harness DAC_LVDS), DAC_CFG (harness DAC_CFG), SDA (bidir), FPGA_CLK, TEMP_ALARM (bidir), PG_M2C (in), TRIG_DIR0_VADJ (out), TRIG_TERM0_VADJ (out), SDA_VADJ (bidir), SCL_VADJ (bidir), TRIG_DIR1_VADJ (out), TRIG_TERM1_VADJ (out), IO_LVDS0, IO_LVDS1, OSC_EN_VADJ (out), REV_ID0 (in), REV_ID1 (in), REV_ID2 (in), REV_ID3 (in), FMC_REF_CLK0, FMC_REF_CLK1, CLK_SEL0_VADJ (out), CLK_SEL1_VADJ (out), LPF_EN_VADJ[3..0] (out), DRV_DIS_VADJ[3..0] (out)
U_DAC_SUPPLY = DAC_SUPPLY.SchDoc: no entries
U_Driver_Filter0 = Driver_Filter.schdoc: IN_P (in), IN_N (in), OUT (out), LPF_EN (in), IC_DIS (in)
U_Driver_Filter1 = Driver_Filter.schdoc: IN_P (in), IN_N (in), OUT (out), LPF_EN (in), IC_DIS (in)
U_Driver_Filter2 = Driver_Filter.schdoc: IN_P (in), IN_N (in), OUT (out), LPF_EN (in), IC_DIS (in)
U_Driver_Filter3 = Driver_Filter.schdoc: IN_P (in), IN_N (in), OUT (out), LPF_EN (in), IC_DIS (in)
U_EEPROM_Temp = EEPROM_Temp.SchDoc: SDA (bidir), SCL (in), GA0 (in), GA1 (in), TEMP_ALARM (bidir)
U_IO_CTRL = IO_CTRL.SchDoc: TRIG_DIR0 (in), IO0 (in), TRIG_TERM0 (in), IO_LVDS0 (harness DIFFSIG), TRIG_DIR1 (in), IO1 (in), TRIG_TERM1 (in), IO_LVDS1 (harness DIFFSIG)
U_PWR_Supply = AWG_PWR_Supply.SchDoc: PG_M2C (out), TEMP_ALARM (bidir)
U_Translators_AWG = Translators_AWG.SchDoc: SDA_VADJ (bidir), SCL_VADJ (bidir), SDA (bidir), SCL (bidir), OSC_EN (out), TRIG_TERM0 (out), TRIG_TERM1 (out), TRIG_DIR0 (out), TRIG_DIR1 (out), TRIG_DIR0_VADJ (in), TRIG_DIR1_VADJ (in), TRIG_TERM0_VADJ (in), TRIG_TERM1_VADJ (in), OSC_EN_VADJ (in), CLK_SEL0 (out), CLK_SEL1 (out), CLK_SEL1_VADJ (in), CLK_SEL0_VADJ (in), LPF_EN[3..0] (out), DRV_DIS[3..0] (out), LPF_EN_VADJ[3..0] (in), DRV_DIS_VADJ[3..0] (in)

### Nets
GND: C109.2 J3.2 J4.2 J6.2 J7.2 J8.2 J9.2 R39.1 R40.1 R42.2 R43.2 R44.2
VADJ: R41.2
CLK_SEL0: sheet U_CLK_INPUT/CLK_SEL0, sheet U_Translators_AWG/CLK_SEL0
CLK_SEL1: sheet U_CLK_INPUT/CLK_SEL1, sheet U_Translators_AWG/CLK_SEL1
GA0: sheet U_DAC_FMC_connector/GA0, sheet U_EEPROM_Temp/GA0
GA1: sheet U_DAC_FMC_connector/GA1, sheet U_EEPROM_Temp/GA1
HA01_CC_N: sheet U_DAC_FMC_connector/SDA_VADJ, sheet U_Translators_AWG/SDA_VADJ
HA01_CC_P: sheet U_DAC_FMC_connector/SCL_VADJ, sheet U_Translators_AWG/SCL_VADJ
HA02_N: sheet U_DAC_FMC_connector/TRIG_TERM0_VADJ, sheet U_Translators_AWG/TRIG_TERM0_VADJ
HA02_P: sheet U_DAC_FMC_connector/TRIG_TERM1_VADJ, sheet U_Translators_AWG/TRIG_TERM1_VADJ
HA05_P: sheet U_PWR_Supply/TEMP_ALARM, sheet U_DAC_FMC_connector/TEMP_ALARM, sheet U_EEPROM_Temp/TEMP_ALARM
HA06_P: sheet U_DAC_FMC_connector/TRIG_DIR0_VADJ, sheet U_Translators_AWG/TRIG_DIR0_VADJ
HA07_P: sheet U_DAC_FMC_connector/TRIG_DIR1_VADJ, sheet U_Translators_AWG/TRIG_DIR1_VADJ
HA13_N: sheet U_DAC_FMC_connector/OSC_EN_VADJ, sheet U_Translators_AWG/OSC_EN_VADJ
HA16_N: sheet U_DAC_FMC_connector/CLK_SEL1_VADJ, sheet U_Translators_AWG/CLK_SEL1_VADJ
HA16_P: sheet U_DAC_FMC_connector/CLK_SEL0_VADJ, sheet U_Translators_AWG/CLK_SEL0_VADJ
IOUTA_N: sheet U_DAC/DACOUTA_N, sheet U_Driver_Filter0/IN_N
IOUTA_P: sheet U_DAC/DACOUTA_P, sheet U_Driver_Filter0/IN_P
IOUTB_N: sheet U_DAC/DACOUTB_N, sheet U_Driver_Filter1/IN_N
IOUTB_P: sheet U_DAC/DACOUTB_P, sheet U_Driver_Filter1/IN_P
IOUTC_N: sheet U_DAC/DACOUTC_N, sheet U_Driver_Filter2/IN_N
IOUTC_P: sheet U_DAC/DACOUTC_P, sheet U_Driver_Filter2/IN_P
IOUTD_N: sheet U_DAC/DACOUTD_N, sheet U_Driver_Filter3/IN_N
IOUTD_P: sheet U_DAC/DACOUTD_P, sheet U_Driver_Filter3/IN_P
PG_M2C: sheet U_PWR_Supply/PG_M2C, sheet U_DAC_FMC_connector/PG_M2C
REV_ID0: R41.1 ; sheet U_DAC_FMC_connector/REV_ID0  [project net HB09_N]
REV_ID1: R42.1 ; sheet U_DAC_FMC_connector/REV_ID1  [project net HB08_P]
REV_ID2: R43.1 ; sheet U_DAC_FMC_connector/REV_ID2  [project net HB08_N]
REV_ID3: R44.1 ; sheet U_DAC_FMC_connector/REV_ID3  [project net HB13_P]
SCL: sheet U_DAC_FMC_connector/SCL, sheet U_EEPROM_Temp/SCL
SDA: sheet U_DAC_FMC_connector/SDA, sheet U_EEPROM_Temp/SDA
SG0: C109.1 J5.2 R39.2 R40.2 ; sheet U_CLK_INPUT/CK_MMCX_GND
NetC6#2_2: J5.1 ; sheet U_CLK_INPUT/CK_MMCX_IN
NetD1_3: J8.1 ; sheet U_IO_CTRL/IO0
NetD2_3: J9.1 ; sheet U_IO_CTRL/IO1
NetIC13_13: sheet U_CLK_INPUT/OSC_EN, sheet U_Translators_AWG/OSC_EN
NetIC14_12: sheet U_Translators_AWG/TRIG_TERM1, sheet U_IO_CTRL/TRIG_TERM1
NetIC14_13: sheet U_Translators_AWG/TRIG_TERM0, sheet U_IO_CTRL/TRIG_TERM0
NetIC14_14: sheet U_Translators_AWG/TRIG_DIR1, sheet U_IO_CTRL/TRIG_DIR1
NetIC14_15: sheet U_Translators_AWG/TRIG_DIR0, sheet U_IO_CTRL/TRIG_DIR0
NetIC15_5: sheet U_CLK_INPUT/OSC_SDA, sheet U_Translators_AWG/SDA
NetIC15_6: sheet U_CLK_INPUT/OSC_SCL, sheet U_Translators_AWG/SCL
NetJ3_1: J3.1 ; sheet U_Driver_Filter0/OUT
NetJ4_1: J4.1 ; sheet U_Driver_Filter1/OUT
NetJ6_1: J6.1 ; sheet U_Driver_Filter2/OUT
NetJ7_1: J7.1 ; sheet U_Driver_Filter3/OUT

### Buses and harness runs
bus DRV_DIS[3..0] = sheet U_Translators_AWG/DRV_DIS[3..0]
bus LPF_EN[3..0] = sheet U_Translators_AWG/LPF_EN[3..0]
bus sheet U_DAC_FMC_connector/DRV_DIS_VADJ[3..0] = sheet U_Translators_AWG/DRV_DIS_VADJ[3..0]
bus sheet U_DAC_FMC_connector/LPF_EN_VADJ[3..0] = sheet U_Translators_AWG/LPF_EN_VADJ[3..0]
harness sheet U_CLK_INPUT/DAC_CLK = sheet U_DAC/DAC_CLK
harness sheet U_CLK_INPUT/FMC_REF_CLK0 = sheet U_DAC_FMC_connector/FMC_REF_CLK0
harness sheet U_CLK_INPUT/FMC_REF_CLK1 = sheet U_DAC_FMC_connector/FMC_REF_CLK1
harness sheet U_CLK_INPUT/FPGA_CLK1 = sheet U_DAC_FMC_connector/FPGA_CLK
harness sheet U_DAC/DAC_CFG = sheet U_DAC_FMC_connector/DAC_CFG
harness sheet U_DAC/DAC_LVDS = sheet U_DAC_FMC_connector/DAC_LVDS
harness sheet U_DAC_FMC_connector/IO_LVDS0 = sheet U_IO_CTRL/IO_LVDS0
harness sheet U_DAC_FMC_connector/IO_LVDS1 = sheet U_IO_CTRL/IO_LVDS1

### Layout directives
net class 50_Ohms: NetC6#2_2, NetD1_3, NetD2_3, NetJ3_1, NetJ4_1, NetJ6_1, NetJ7_1

### Notes on the sheet
- (near J5) Ext clock input
- (near R44) Board revision
- Project/Equipment
- Document
- Designer
- Drawn by
- Check.by
- Copyright WUT ISE 2018.
  This documentation describes Open Hardware and is licensed under the CERN OHL v.1.1. You may redistribute and modify this documentation under the terms of the CERN OHL v.1.1. (http://ohwr.org/CERNOHL). This documentation is distributed WITHOUT ANY EXPRESS OR IMPLIED WARRANTY, INCLUDING OF MERCHANTABILITY, SATISFACTORY QUALITY AND FITNESS FOR A PARTICULAR PURPOSE. Please see the CERN OHL v.1.1 for applicable conditions.
- Contact
- File
- Last Mod.
- Print Date
- Sheet
- Size
- A3
- of
- Rev
- (in symbol R0402_100K_1%_0.0625W_100PPM) 1%
- (in symbol R0402_470R_1%_0.0625W_100PPM) 1%

### Library data of the parts
C109 = CC0402_10NF_16V_10%_X7R: Non-polarised capacitor; Part Description: SMD Multilayer Chip Ceramic Capacitor; Manufacturer: GENERIC; Manufacturer1 Part Number: 223878715636; Voltage: 16V; TC: X7R; Tolerance: ±10%; Part Number: CC0402_10NF_16V_10%_X7R; Component Kind: Standard; Component Type: Standard; Pin Count: 2; Value: 10nF; Status: Not Recommended; Manufacturer Part Number: CC0402_10NF_16V_10%_X7R; Case: 0402; Mounted: Yes; Socket: No; SMD: Yes; Sense: No; Manufacturer1 Example: PHYCOMP; Manufacturer1 ComponentHeight: 0.55mm; HelpURL: \\cern.ch\dfs\Applications\Altium\Datasheets\CC0402_X7R_PHYCOMP.pdf; Author: CERN DEM JLC; CreateDate: 2007-12-03; LatestRevisionDate: 2007-12-03
FTG1 = FIDUCIAL_TARGET_C100-200: Fiducial Target; Part Description: Round Fiducial Target, Top Layer, 1.0mm, Top Solder 2.0mm, Keepout =2.0mm; Mounted: No; Part Number: FIDUCIAL_TARGET_C100-200; Component Type: Standard (No BOM); Pin Count: 1; Family: Fiducial; Socket: No; SMD: Yes; Sense: No; Status: None; ComponentHeight: 0mm; HelpURL: Undefined; Author: CERN DEM JLC; CreateDate: 09.02.2010; LatestRevisionDate: 04.04.2012; PackageDescription: Round Fiducial Target, Top Layer, 1.0mm, Top Solder 2.0mm, Keepout =2.0mm
FTG2-FTG4 = FIDUCIAL_TARGET_S100-200: Fiducial Target; Part Description: Square Fiducial Target, Top Layer, 1.0mm, Top Solder 2.0mm, Keepout =2.0mm; Mounted: No; Part Number: FIDUCIAL_TARGET_S100-200; Component Type: Standard (No BOM); Pin Count: 1; Family: Fiducial; Socket: No; SMD: Yes; Sense: No; Status: None; ComponentHeight: 0mm; HelpURL: Undefined; Author: CERN DEM JLC; CreateDate: 09.02.2010; LatestRevisionDate: 04.04.2012; PackageDescription: Square Fiducial Target, Top Layer, 1.0mm, Top Solder 2.0mm, Keepout =2.0mm
J3 J4 J6 J7 = Coax_1Female_1Shield: Part Description: 50 Ohm Through Hole SMA 90 degrees PCB Jack; Manufacturer: AMPHENOL; Manufacturer Part Number: 901-143; PressFit: No; Part Number: AMPHENOL_901-143; Component Kind: Standard; Component Type: Standard; Pin Count: 5; Family: SMA; Mounted: Yes; Socket: No; SMD: No; Sense: No; Status: None; ComponentHeight: 10.0mm; Author: LNLS DIG GBMB; CreateDate: 31/05/2016; LatestRevisionDate: 31/05/2016
J5 J8 J9 = HUBER-SUHNER_85_MMCX-50-0-1/111 OH: Part Description: MMCX 50 Ohms Right Angle PCB Jack; Manufacturer: HUBER+SUHNER; Table: Miscellaneous; Part Number: HUBER-SUHNER_85_MMCX-50-0-1/111 OH; Component Kind: Standard; Component Type: Standard; Pin Count: 2; Mounted: Yes; Socket: No; SMD: No; Status: None; Manufacturer Part Number: 85_MMCX-50-0-1/111 OH; ComponentHeight: 9.6mm; HelpURL: \\cern.ch\dfs\Applications\Altium\Datasheets\HUBER-SUHNER_85_MMCX-50-0-1-111 OH.pdf; Author: CERN DEM JLC; CreateDate: 2011-10-04; LatestRevisionDate: 2011-10-04
R39 = R0402_100K_1%_0.0625W_100PPM: Resistor - 1%; Part Description: General Purpose Thick Film Chip Resistor; Manufacturer: GENERIC; Manufacturer1 Part Number: 232270671004L; PressFit: No; TC: ±100ppm/°C; Part Number: R0402_100K_1%_0.0625W_100PPM; Component Kind: Standard; Component Type: Standard; Pin Count: 2; Value: 100k; Status: Not Recommended; Manufacturer Part Number: R0402_100K_1%_0.0625W_100PPM; Case: 0402; Mounted: Yes; Sense: No; Socket: No; SMD: Yes; Manufacturer1 Example: YAGEO PHYCOMP; Manufacturer1 ComponentHeight: 0.4mm; HelpURL: \\cern.ch\dfs\Applications\Altium\Datasheets\R0402_Phycomp_RC0402.pdf; Author: CERN DEM JLC; CreateDate: 03.12.2007; LatestRevisionDate: 17.10.2012; Power: 0.0625W; Tolerance: ±1%
R40 = R0603_0R_JUMPER: Resistor; Part Description: 1A (0.05R Max DC Resistance) Zero Ohm Jumper; Manufacturer: GENERIC; Manufacturer1 Part Number: NRC06Z0; PressFit: No; Part Number: R0603_0R_JUMPER; Component Kind: Standard; Component Type: Standard; Pin Count: 2; Value: 0; Status: Preferred; Manufacturer Part Number: R0603_0R_JUMPER; Case: 0603; Mounted: Yes; Sense: No; Socket: No; SMD: Yes; Manufacturer1 Example: NIC COMPONENT; Manufacturer1 ComponentHeight: 0.55mm; HelpURL: \\cern.ch\dfs\Applications\Altium\Datasheets\R0603_NIC_NRC.pdf; Author: CERN DEM JLC; CreateDate: 03.12.2007; LatestRevisionDate: 13.03.2008
R41-R44 = R0402_470R_1%_0.0625W_100PPM: Resistor - 1%; Part Description: General Purpose Thick Film Chip Resistor; Manufacturer: GENERIC; Manufacturer1 Part Number: 232270674701L; TC: ±100ppm/°C; PressFit: No; Part Number: R0402_470R_1%_0.0625W_100PPM; Component Kind: Standard; Component Type: Standard; Pin Count: 2; Value: 470; Status: Not Recommended; Power: 0.0625W; Tolerance: ±1%; Manufacturer Part Number: R0402_470R_1%_0.0625W_100PPM; Case: 0402; Mounted: Yes; Sense: No; Socket: No; SMD: Yes; Manufacturer1 Example: YAGEO PHYCOMP; Manufacturer1 ComponentHeight: 0.4mm; HelpURL: \\cern.ch\dfs\Applications\Altium\Datasheets\R0402_Phycomp_RC0402.pdf; Author: CERN DEM JLC; CreateDate: 03.12.2007; LatestRevisionDate: 17.10.2012

## Sheet AWG_PWR_Supply.SchDoc: FMC DAC 1.5GS 4CH
size 420 x 297 mm; Author: G.Kasprowicz; CompanyName: WUT ISE; DrawnBy: G.Kasprowicz; Organization: WUT ISE; Address1: PW ISE; Address2: Nowowiejska 15/19 00-665 Warsaw; Address3: gkasprow@gmail.com; DocumentNumber: 17; Revision: 1; SheetNumber: 17; SheetTotal: 18; ModifiedBy: -; CheckedDate: -; Title2: P5V5 power rail and converters; DivGrp: WUT ISE; Designer: G.Kasprowicz; ModifiedDate: -; ProjectName: Sensor Box
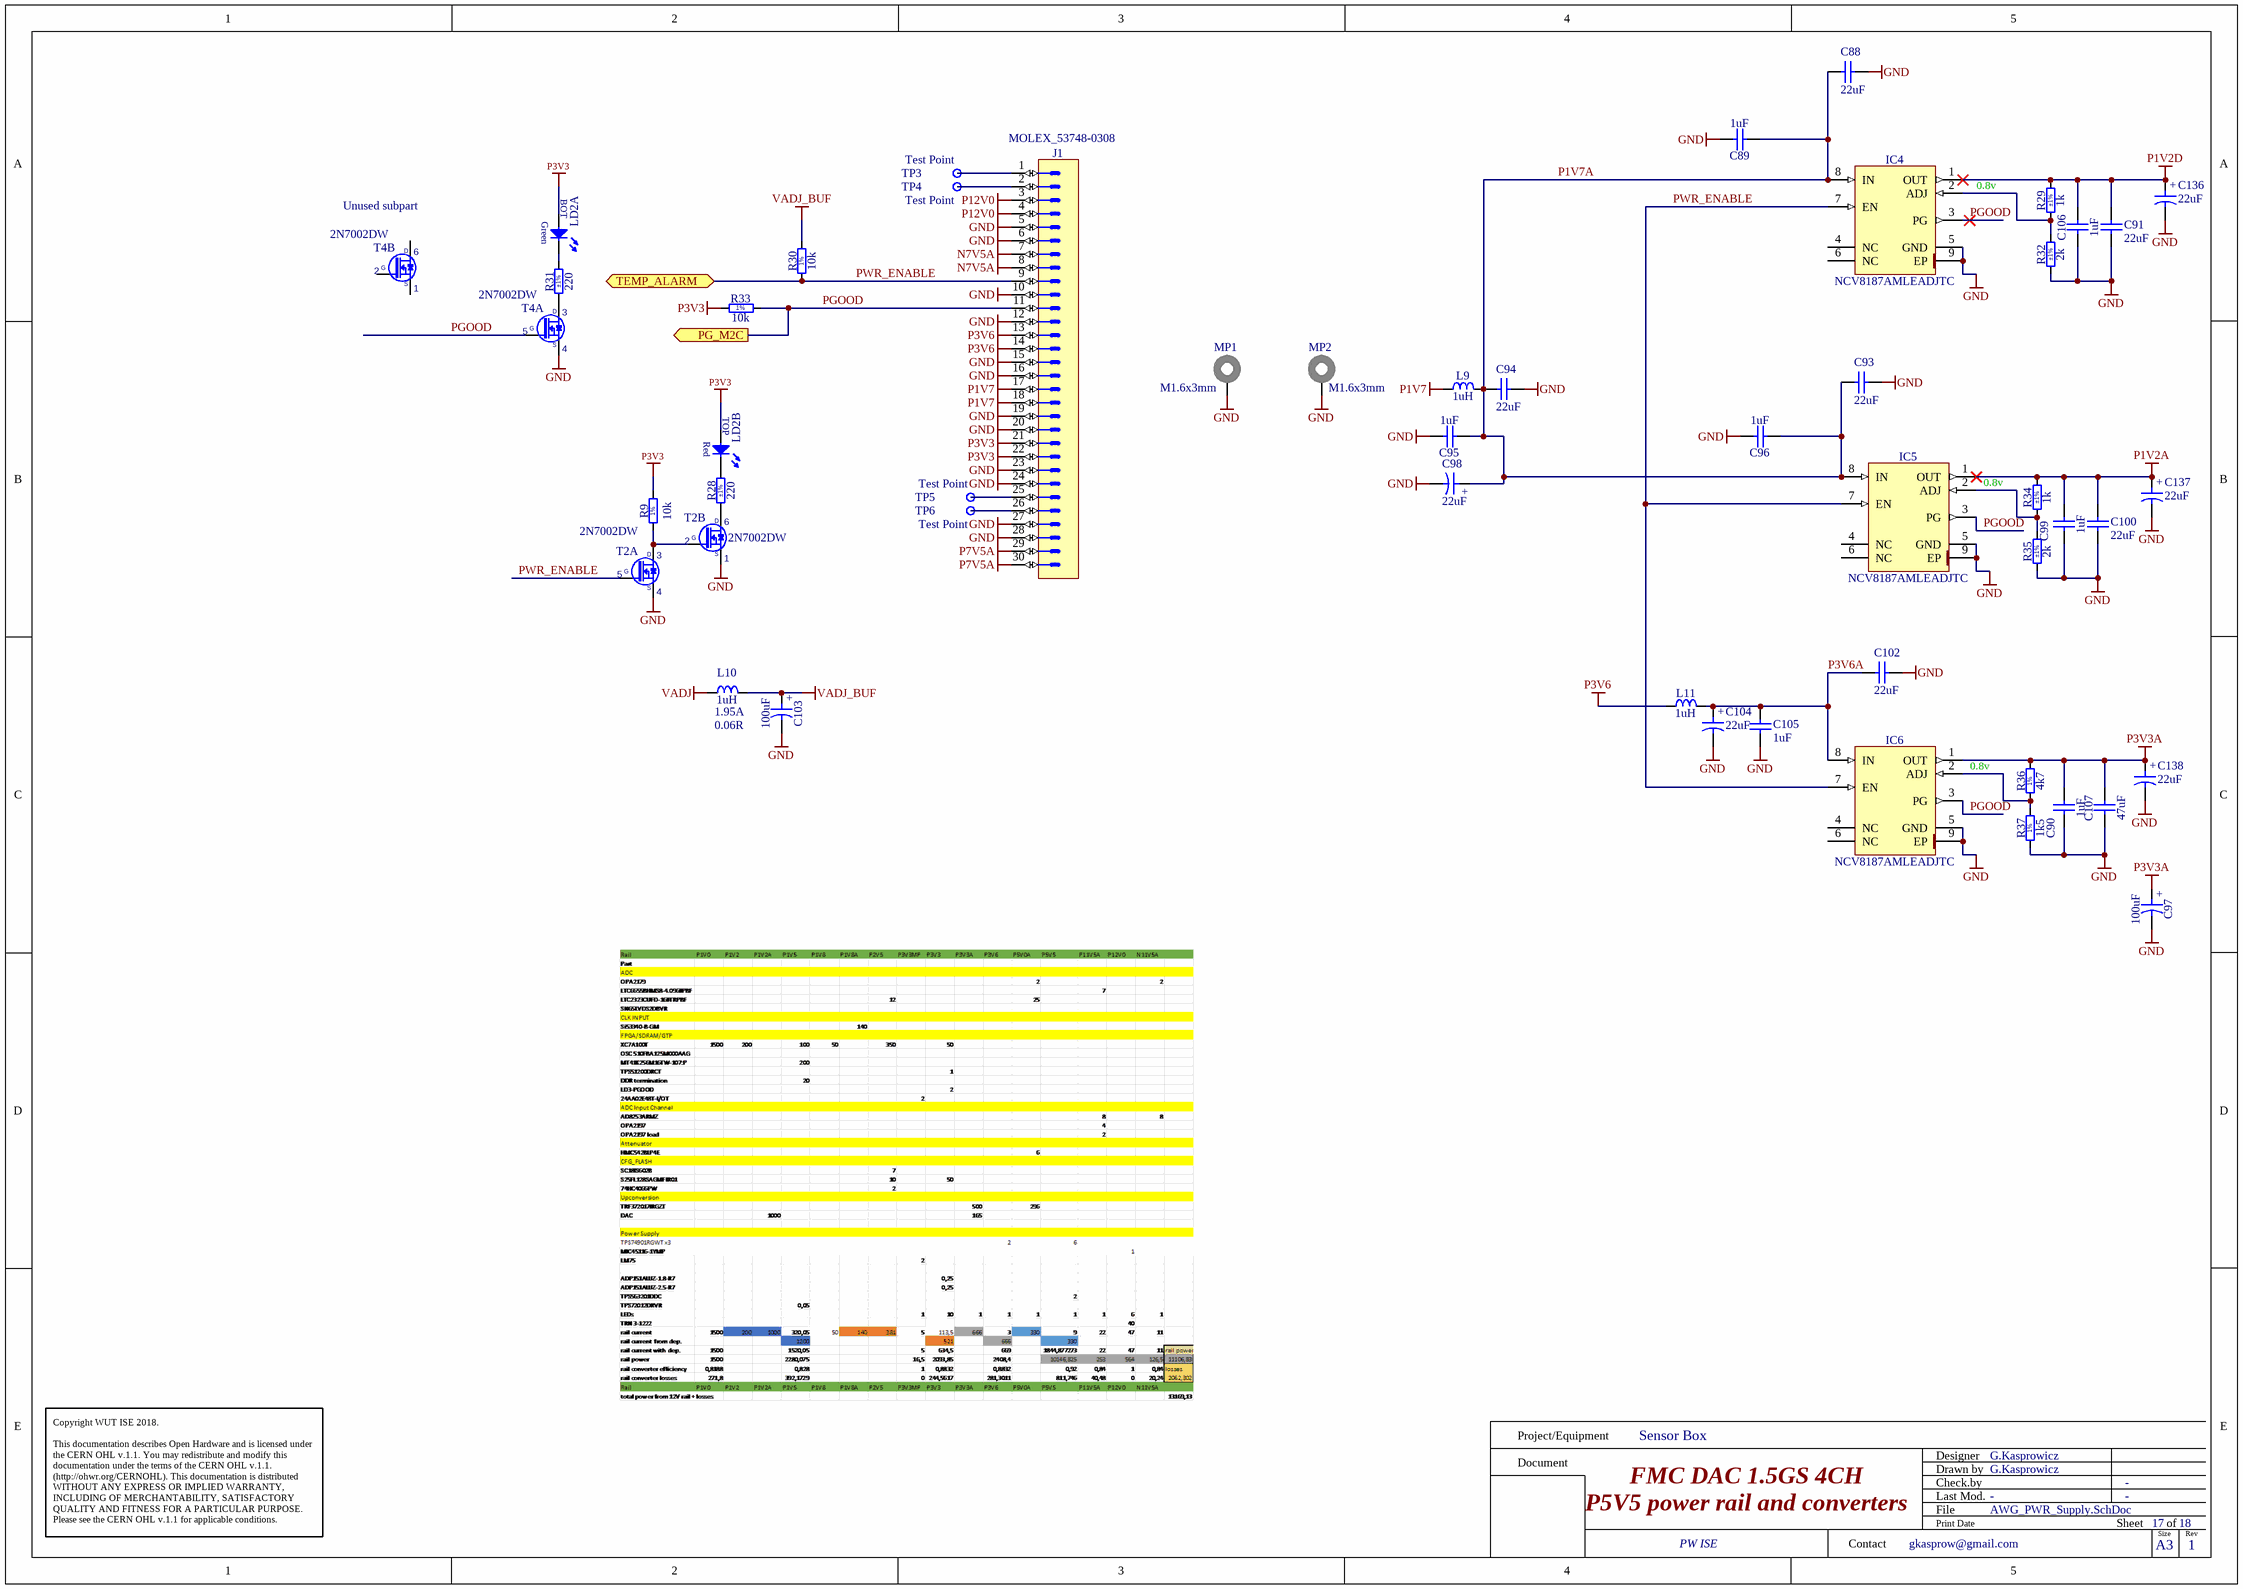
[diagram p4: AWG_PWR_Supply.SchDoc]

### Parts
(Parts that share a designator on the sheet are numbered #1, #2 ... from top to bottom, then left to right.)
C88  22uF  [CAPC2012X135N]
C89  1uF  [CAPC1005X55N]
C90  1uF  [CAPC1005X55N]
C91  22uF  [CAPC2012X135N]
C93  22uF  [CAPC2012X135N]
C94  22uF  [CAPC2012X135N]
C95  1uF  [CAPC1005X55N]
C96  1uF  [CAPC1005X55N]
C97  100uF  [CAPMP3216X180N]
C98  22uF  [CAPMP3528X210N]
C99  1uF  [CAPC1005X55N]
C100  22uF  [CAPC2012X135N]
C102  22uF  [CAPC2012X135N]
C103  100uF  [CAPMP3216X180N]
C104  22uF  [CAPMP3528X210N]
C105  1uF  [CAPC1005X55N]
C106  1uF  [CAPC1005X55N]
C107  47uF  [CAPC3225X270N]
C136  22uF  [CAPMP3528X210N]
C137  22uF  [CAPMP3528X210N]
C138  22uF  [CAPMP3528X210N]
IC4  NCV8187AMLEADJTC  [SON50P300X300X100-9N-R175X250]
IC5  NCV8187AMLEADJTC  [SON50P300X300X100-9N-R175X250]
IC6  NCV8187AMLEADJTC  [SON50P300X300X100-9N-R175X250]
J1  SlimStack™  [MOLEX_53748-0308]  (value not drawn)
L9  1uH  [INDC2620X100N]
L10  1uH  Power: 1.95A  Resistance: 0.06R  [INDC2620X100N]
L11  1uH  [INDC2620X100N]
LD2  Red/Green  [LED_DIALIGHT_571-0112F]  (value not drawn)  (parts A,B of 2)
MP1  M1.6x3mm  [9774030633]
MP2  M1.6x3mm  [9774030633]
R9#2  10k  [RESC1005X40N]
R28  220  Tolerance: ±1%  [RESC1005X40N]
R29  1k  Tolerance: ±1%  [RESC1005X40N]
R30  10k  [RESC1005X40N]
R31  220  Tolerance: ±1%  [RESC1005X40N]
R32  2k  Tolerance: ±1%  [RESC1005X40N]
R33  10k  [RESC1005X40N]
R34  1k  Tolerance: ±1%  [RESC1005X40N]
R35  2k  Tolerance: ±1%  [RESC1005X40N]
R36  4k7  [RESC1608X55N]
R37  1k5  [RESC1608X55N]
T2  2N7002DW  [SOT65P210X110-6N]  (parts A,B of 2)
T4  2N7002DW  [SOT65P210X110-6N]  (parts A,B of 2)
TP3  Test Point  [TPS127]  (no BOM)
TP4  Test Point  [TPS127]  (no BOM)
TP5  Test Point  [TPS127]  (no BOM)
TP6  Test Point  [TPS127]  (no BOM)

### Ports
PG_M2C (out), TEMP_ALARM (bidir)

### Nets
GND: C88.1 C89.2 C90.1 C91.2 C93.1 C94.1 C95.2 C96.2 C97.2 C98.2 C99.1 C100.2 C102.1 C103.2 C104.2 C105.2 C106.1 C107.1 C136.2 C137.2 C138.2 IC4.5(GND) IC4.9(EP) IC5.5(GND) IC5.9(EP) IC6.5(GND) IC6.9(EP) J1.5 J1.6 J1.10 J1.12 J1.15 J1.16 J1.19 J1.20 J1.23 J1.24 J1.27 J1.28 MP1.1 MP2.1 R32.1 R35.1 R37.1 T2.1(S2) T2.4(S1) T4.4(S1)
N7V5A: J1.7 J1.8
P1V2A: C99.2 C100.1 C137.1 IC5.1(OUT) R34.2
P1V2D: C91.1 C106.2 C136.1 IC4.1(OUT) R29.2
P1V7: J1.17 J1.18 L9.1
P3V3: J1.21 J1.22 LD2.2(A) LD2.4(A) R9#2.2 R33.1
P3V3A: C90.2 C97.1 C107.2 C138.1 IC6.1(OUT) R36.2
P3V6: J1.13 J1.14 L11.1
P7V5A: J1.29 J1.30
P12V0: J1.3 J1.4
VADJ: L10.1
VADJ_BUF: C103.1 L10.2 R30.2
P1V7A: C88.2 C89.1 C93.2 C94.2 C95.1 C96.1 C98.1 IC4.8(IN) IC5.8(IN) L9.2
P3V6A: C102.2 C104.1 C105.1 IC6.8(IN) L11.2
PGOOD: IC4.3(PG) IC5.3(PG) IC6.3(PG) J1.11 R33.2 T4.5(G1) ; port PG_M2C  [project net PG_M2C]
PWR_ENABLE: IC4.7(EN) IC5.7(EN) IC6.7(EN) J1.9 R30.1 T2.5(G1) ; port TEMP_ALARM  [project net HA05_P]
NetIC4_2: IC4.2(ADJ) R29.1 R32.2
NetIC5_2: IC5.2(ADJ) R34.1 R35.2
NetIC6_2: IC6.2(ADJ) R36.1 R37.2
NetJ1_1: J1.1 TP3.1
NetJ1_2: J1.2 TP4.1
NetJ1_25: J1.25 TP5.1
NetJ1_26: J1.26 TP6.1
NetLD2_1: LD2.1(C) R31.2
NetLD2_3: LD2.3(C) R28.2
NetR9#2_1: R9#2.1 T2.2(G2) T2.3(D1)
NetR28_1: R28.1 T2.6(D2)
NetR31_1: R31.1 T4.3(D1)

Not connected (* = marked no-connect by the designer): IC4 4(NC) 6(NC); IC5 4(NC) 6(NC); IC6 4(NC) 6(NC); T4 1(S2) 2(G2) 6(D2)

### Notes on the sheet
- 0.8v
- (near T4) Unused subpart
- Project/Equipment
- Document
- Designer
- Drawn by
- Check.by
- Copyright WUT ISE 2018.
  This documentation describes Open Hardware and is licensed under the CERN OHL v.1.1. You may redistribute and modify this documentation under the terms of the CERN OHL v.1.1. (http://ohwr.org/CERNOHL). This documentation is distributed WITHOUT ANY EXPRESS OR IMPLIED WARRANTY, INCLUDING OF MERCHANTABILITY, SATISFACTORY QUALITY AND FITNESS FOR A PARTICULAR PURPOSE. Please see the CERN OHL v.1.1 for applicable conditions.
- Contact
- File
- Last Mod.
- Print Date
- Sheet
- Size
- A3
- of
- Rev
- (in symbol 2N7002DW, part A) D; G; S
- (in symbol 2N7002DW, part B) D; G; S
- (in symbol CTE3216-18_100UF_6.3V_20%_ESR0500_AVX_TLJ) +
- (in symbol CTE3528-21_22UF_10V_10%_LESR0700) +
- (in symbol LED_DIALIGHT_571-0112F, part A) BOT; Green
- (in symbol LED_DIALIGHT_571-0112F, part B) TOP; Red
- (in symbol R0402_10K_1%_0.0625W_100PPM) 1%
- (in symbol R0603_1K5_1%_0.1W_100PPM) 1%
- (in symbol R0603_4K7_1%_0.1W_100PPM) 1%

### Library data of the parts
C88 C91 C93 C94 C100 C102 = CC0805_22UF_16V_10%_X5R: as C229 on sheet FMC_AWG_DAC_PSU_LDO; Part Number: CC0805_22UF_16V_10%_X5R; Component Kind: Standard; Component Type: Standard; Pin Count: 2; Value: 22uF; Status: Preferred; Manufacturer Part Number: CC0805_22UF_16V_10%_X5R; Case: 0805; Mounted: Yes; Socket: No; SMD: Yes; Sense: No; Manufacturer1 Example: TDK; Manufacturer1 ComponentHeight: 1.35mm; HelpURL: \\cern.ch\dfs\Applications\Altium\Datasheets\CC0805_X5R_TDK_C.pdf; Author: CERN DEM JLC; CreateDate: 25.10.2012; LatestRevisionDate: 25.10.2012
C89 C90 C95 C96 C99 C105 C106 = CC0402_1UF_16V_10%_X5R: Non-polarised capacitor; Part Description: SMD Multilayer Chip Ceramic Capacitor; Manufacturer: GENERIC; Manufacturer1 Part Number: C1005X5R1C105KT; Voltage: 16V; TC: X5R; Tolerance: ±10%; Part Number: CC0402_1UF_16V_10%_X5R; Component Kind: Standard; Component Type: Standard; Pin Count: 2; Value: 1uF; Status: Preferred; Manufacturer Part Number: CC0402_1UF_16V_10%_X5R; Case: 0402; Mounted: Yes; Socket: No; SMD: Yes; Sense: No; Manufacturer1 Example: TDK; Manufacturer1 ComponentHeight: 0.55mm; HelpURL: \\cern.ch\dfs\Applications\Altium\Datasheets\CC0402_X5R_TDK_C.pdf; Author: CERN DEM JLC; CreateDate: 2012-10-25; LatestRevisionDate: 2012-10-25
C97 C103 = CTE3216-18_100UF_6.3V_20%_ESR0500_AVX_TLJ: Polarised capacitor; Part Description: ESR 0R5 Solid Tantalum Chip Capacitor; Manufacturer: AVX; Manufacturer Part Number: TLJA107M006R0500; Voltage: 6.3V; Tolerance: ±20%; Part Number: CTE3216-18_100UF_6.3V_20%_ESR0500_AVX_TLJ; Component Kind: Standard; Component Type: Standard; Pin Count: 2; Value: 100uF; Status: None; Case: A; Mounted: Yes; Socket: No; SMD: Yes; Sense: No; HelpURL: \\cern.ch\dfs\Applications\Altium\Datasheets\CTE_AVX_TLJ.pdf; Author: CERN DEM JLC; CreateDate: 19.12.2013; LatestRevisionDate: 19.12.2013; ComponentHeight: 1.8mm
C98 C104 C136-C138 = CTE3528-21_22UF_10V_10%_LESR0700: Polarised capacitor; Part Description: Low ESR 0R7 Solid Tantalum Chip Capacitor; Manufacturer: GENERIC; Manufacturer1 Part Number: TPSB226K010R0700; Voltage: 10V; Tolerance: ±10%; Part Number: CTE3528-21_22UF_10V_10%_LESR0700; Component Kind: Standard; Component Type: Standard; Pin Count: 2; Value: 22uF; Status: Preferred; Manufacturer Part Number: CTE3528-21_22UF_10V_10%_LESR0700; Case: B; Mounted: Yes; Socket: No; SMD: Yes; Sense: No; Manufacturer1 Example: AVX; Manufacturer1 ComponentHeight: 2.1mm; HelpURL: \\cern.ch\dfs\Applications\Altium\Datasheets\CTE-LESR_AVX_TPS.pdf; Author: CERN DEM JLC; CreateDate: 05.05.2008; LatestRevisionDate: 20.01.2009
C107 = CC1210_47UF_10V_20%_X5R: Non-polarised capacitor; Part Description: SMD Multilayer Chip Ceramic Capacitor; Manufacturer: GENERIC; Manufacturer1 Part Number: LMK325BJ476MM-T; Voltage: 10V; TC: X5R; Tolerance: ±20%; Part Number: CC1210_47UF_10V_20%_X5R; Component Kind: Standard; Component Type: Standard; Pin Count: 2; Value: 47uF; Status: None; Manufacturer Part Number: CC1210_47UF_10V_20%_X5R; Case: 1210; Mounted: Yes; Socket: No; SMD: Yes; Sense: No; Manufacturer1 Example: TAIYO YUDEN; Manufacturer1 ComponentHeight: 2.7mm; HelpURL: \\cern.ch\dfs\Applications\Altium\Datasheets\CC1210_X5R_TAIYO-YUDEN_HIGH-VALUE.pdf; Author: CERN DEM JLC; CreateDate: 04.05.2011; LatestRevisionDate: 04.05.2011
IC4-IC6 = NCV8187AMLEADJTC: Adjustable, 1.2A, Voltage Regulator - Low Iq, Low Dropout, Power Good Output; Manufacturer: ON SEMICONDUCTOR; PressFit: No; Bonding: No; Part Number: NCV8187AMLEADJTC; Component Kind: Standard; Component Type: Standard; Device: NCV8187AMLEADJTC; PackageDescription: SON, (DFN) 0.50mm Pitch; 8 Pin, 3.00mm W X 3.00mm L X 1.00mm H body (w/Thermal Tab 1.75 X 2.50mm), IPC Medium Density; Part Description: Adjustable, 1.2A, Voltage Regulator - Low Iq, Low Dropout, Power Good Output; Manufacturer Part Number: NCV8187AMLEADJTC; Pin Count: 9; Case: SON8; Mounted: Yes; Socket: No; SMD: Yes; Sense: No; ComponentHeight: 1mm; HelpURL: \\cern.ch\dfs\Applications\Altium\Datasheets\NCV8187.pdf; Author: CERN DEM HF; CreateDate: 18.05.2022; LatestRevisionDate: 18.05.2022
J1 = MOLEX_53748-0308: Connector 30 Male; Part Description: 0.50mm Pitch SlimStack™ Dual Row 30 Circuits Surface Mount Vertical Plug (3.00 Stacking Heights); Manufacturer: MOLEX; PressFit: No; Part Number: MOLEX_53748-0308; Component Kind: Standard; Component Type: Standard; Pin Count: 30; Family: SlimStack™; Mounted: Yes; Socket: No; SMD: Yes; Sense: No; Status: None; Manufacturer Part Number: 53748-0308; ComponentHeight: 2.4mm; HelpURL: \\cern.ch\dfs\Applications\Altium\Datasheets\MOLEX_53748-0308.pdf; Author: CERN DEM JLC; CreateDate: 28.08.2012; LatestRevisionDate: 28.08.2012
L9 L11 = IND1008_1UH_20%_WURTH_74479787210B: as L204 on sheet FMC_AWG_DAC_PSU_LDO; Part Number: IND1008_1UH_20%_WURTH_74479787210B; Component Kind: Standard; Component Type: Standard; Pin Count: 2; Value: 1uH; Status: None; Manufacturer Part Number: 74479787210B; Mounted: Yes; Socket: No; SMD: Yes; Sense: No; ComponentHeight: 1mm; HelpURL: \\cern.ch\dfs\Applications\Altium\Datasheets\IND_WURTH_WE-PMI_74479787210B.pdf; Author: CERN DEM JLC; CreateDate: 01.10.2014; LatestRevisionDate: 01.10.2014; Case: 1008
L10 = IND1008_1UH_20%_WURTH_74479787210B: Inductor; Part Description: Power Multilayer Inductor (WE-PMI Series); Manufacturer: WURTH ELEKTRONIK; Tolerance: ±20%; Part Number: IND1008_1UH_20%_WURTH_74479787210B; Component Kind: Standard; Component Type: Standard; Pin Count: 2; Value: 1uH; Status: None; Manufacturer Part Number: 74479787210B; Mounted: Yes; Socket: No; SMD: Yes; Sense: No; ComponentHeight: 1mm; HelpURL: \\cern.ch\dfs\Applications\Altium\Datasheets\IND_WURTH_WE-PMI_74479787210B.pdf; Author: CERN DEM JLC; CreateDate: 01.10.2014; LatestRevisionDate: 01.10.2014; Case: 1008
LD2 = LED_DIALIGHT_571-0112F: 2x LED Botom Green, Top Red; Part Description: Dual 2mm  LEDs, Red Top,Green Bot, CBI® Circuit Board Indicator (Without positioning pins); PressFit: No; Bonding: No; Part Number: LED_DIALIGHT_571-0112F; Component Kind: Standard; Component Type: Standard; Color: Red/Green; PackageDescription: 2x 2mm LED (Top: Red, Bot: Green) PCB Edge Mounting (Without positioning pins) DIALIGHT 571 Serie; Manufacturer: DIALIGHT; Manufacturer Part Number: 571-0112F; Pin Count: 4; Mounted: Yes; Socket: No; SMD: No; Sense: No; ComponentHeight: 8.6mm; HelpURL: \\cern.ch\dfs\Applications\Altium\Datasheets\LED_DIALIGHT_571-0112F.pdf; Author: CERN DEM JLC; CreateDate: 09.11.2009; LatestRevisionDate: 17.03.2010
MP1 MP2 = 9774030633R: WA-SMSI SMT Steel Spacer, M1.6 Thread Internal, OD 3.3mm, M1.6x3mm; Manufacturer: Wurth Elektronik; Inner Diameter: 1.9mm; Surface: Tin; ComponentLink1Description: Manufacturer; ComponentLink1URL: http://www.we-online.de; ComponentLink2Description: Datasheet; ComponentLink2URL: https://www.we-online.com/catalog/datasheet/9774030633R.pdf; Mounting Technology: SMT; Packaging: Tape and Reel; Manufacturer Part Number: 9774030633R; Length: 3mm; Inner Thread Length: -; Operating Temperature: -55 to +150degC; Outer Diameter: 3.3mm; Published Date: April 2020; Material: Steel; Thread: M1.6
R9#2 R30 = R0402_10K_1%_0.0625W_100PPM: Resistor - 1%; Part Description: General Purpose Thick Film Chip Resistor; Manufacturer: GENERIC; Manufacturer1 Part Number: 232270671003L; TC: ±100ppm/°C; Table: Resistors SMD; Part Number: R0402_10K_1%_0.0625W_100PPM; Component Kind: Standard; Component Type: Standard; Pin Count: 2; Value: 10k; Status: Not recommended; Power: 0.0625W; Tolerance: ±1%; Manufacturer Part Number: R0402_10K_1%_0.0625W_100PPM; Case: 0402; Mounted: Yes; Socket: No; SMD: Yes; Manufacturer1 Example: YAGEO PHYCOMP; Manufacturer1 ComponentHeight: 0.4mm; HelpURL: \\cern.ch\dfs\Applications\Altium\Datasheets\R0402_Phycomp_RC0402.pdf; Author: CERN DEM JLC; CreateDate: 3/12/2007; LatestRevisionDate: 17/10/2012
R28 R31 = R0402_220R_1%_0.0625W_100PPM: Resistor - 1%; Part Description: General Purpose Thick Film Chip Resistor; Manufacturer: GENERIC; Manufacturer1 Part Number: 232270672201L; TC: ±100ppm/°C; PressFit: No; Part Number: R0402_220R_1%_0.0625W_100PPM; Component Kind: Standard; Component Type: Standard; Pin Count: 2; Value: 220; Status: Not Recommended; Power: 0.0625W; Manufacturer Part Number: R0402_220R_1%_0.0625W_100PPM; Case: 0402; Mounted: Yes; Sense: No; Socket: No; SMD: Yes; Manufacturer1 Example: YAGEO PHYCOMP; Manufacturer1 ComponentHeight: 0.4mm; HelpURL: \\cern.ch\dfs\Applications\Altium\Datasheets\R0402_Phycomp_RC0402.pdf; Author: CERN DEM JLC; CreateDate: 03.12.2007; LatestRevisionDate: 17.10.2012
R29 R34 = R0402_1K_1%_0.0625W_100PPM: Resistor - 1%; Part Description: General Purpose Thick Film Chip Resistor; Manufacturer: GENERIC; Manufacturer1 Part Number: 232270671002L; TC: ±100ppm/°C; PressFit: No; Part Number: R0402_1K_1%_0.0625W_100PPM; Component Kind: Standard; Component Type: Standard; Pin Count: 2; Value: 1k; Status: Not Recommended; Power: 0.0625W; Manufacturer Part Number: R0402_1K_1%_0.0625W_100PPM; Case: 0402; Mounted: Yes; Sense: No; Socket: No; SMD: Yes; Manufacturer1 Example: YAGEO PHYCOMP; Manufacturer1 ComponentHeight: 0.4mm; HelpURL: \\cern.ch\dfs\Applications\Altium\Datasheets\R0402_Phycomp_RC0402.pdf; Author: CERN DEM JLC; CreateDate: 03.12.2007; LatestRevisionDate: 17.10.2012
R32 R35 = R0402_2K_1%_0.0625W_100PPM: Resistor - 1%; Part Description: General Purpose Thick Film Chip Resistor; Manufacturer: GENERIC; Manufacturer1 Part Number: 232270672002L; TC: ±100ppm/°C; PressFit: No; Part Number: R0402_2K_1%_0.0625W_100PPM; Component Kind: Standard; Component Type: Standard; Pin Count: 2; Value: 2k; Status: Not Recommended; Power: 0.0625W; Manufacturer Part Number: R0402_2K_1%_0.0625W_100PPM; Case: 0402; Mounted: Yes; Sense: No; Socket: No; SMD: Yes; Manufacturer1 Example: YAGEO PHYCOMP; Manufacturer1 ComponentHeight: 0.4mm; HelpURL: \\cern.ch\dfs\Applications\Altium\Datasheets\R0402_Phycomp_RC0402.pdf; Author: CERN DEM JLC; CreateDate: 03.12.2007; LatestRevisionDate: 17.10.2012
R33 = R0402_10K_1%_0.0625W_100PPM: as R226 on sheet FMC_AWG_DAC_PSU_LDO; Part Number: R0402_10K_1%_0.0625W_100PPM; Component Kind: Standard; Component Type: Standard; Pin Count: 2; Value: 10k; Status: Not Recommended; Power: 0.0625W; Tolerance: ±1%; Manufacturer Part Number: R0402_10K_1%_0.0625W_100PPM; Case: 0402; Mounted: Yes; Sense: No; Socket: No; SMD: Yes; Manufacturer1 Example: YAGEO PHYCOMP; Manufacturer1 ComponentHeight: 0.4mm; HelpURL: \\cern.ch\dfs\Applications\Altium\Datasheets\R0402_Phycomp_RC0402.pdf; Author: CERN DEM JLC; CreateDate: 03.12.2007; LatestRevisionDate: 17.10.2012
R36 = R0603_4K7_1%_0.1W_100PPM: Resistor - 1%; Part Description: General Purpose Thick Film Chip Resistor; Manufacturer: GENERIC; Manufacturer1 Part Number: NRC06F4701TRF; Power: 0.1W; TC: ±100ppm/°C; PressFit: No; Part Number: R0603_4K7_1%_0.1W_100PPM; Component Kind: Standard; Component Type: Standard; Pin Count: 2; Value: 4k7; Status: Preferred; Tolerance: ±1%; Manufacturer Part Number: R0603_4K7_1%_0.1W_100PPM; Case: 0603; Mounted: Yes; Sense: No; Socket: No; SMD: Yes; Manufacturer1 Example: NIC COMPONENT; Manufacturer1 ComponentHeight: 0.55mm; HelpURL: \\cern.ch\dfs\Applications\Altium\Datasheets\R0603_NIC_NRC.pdf; Author: CERN DEM JLC; CreateDate: 03.12.2007; LatestRevisionDate: 13.03.2008
R37 = R0603_1K5_1%_0.1W_100PPM: Resistor - 1%; Part Description: General Purpose Thick Film Chip Resistor; Manufacturer: GENERIC; Manufacturer1 Part Number: NRC06F1501TRF; Power: 0.1W; TC: ±100ppm/°C; PressFit: No; Part Number: R0603_1K5_1%_0.1W_100PPM; Component Kind: Standard; Component Type: Standard; Pin Count: 2; Value: 1k5; Status: Preferred; Tolerance: ±1%; Manufacturer Part Number: R0603_1K5_1%_0.1W_100PPM; Case: 0603; Mounted: Yes; Sense: No; Socket: No; SMD: Yes; Manufacturer1 Example: NIC COMPONENT; Manufacturer1 ComponentHeight: 0.55mm; HelpURL: \\cern.ch\dfs\Applications\Altium\Datasheets\R0603_NIC_NRC.pdf; Author: CERN DEM JLC; CreateDate: 03.12.2007; LatestRevisionDate: 13.03.2008
T2 T4 = 2N7002DW: as T200 on sheet FMC_AWG_DAC_PSU_LDO; Part Number: 2N7002DW; Component Kind: Standard; Component Type: Standard; Device: 2N7002DW; PackageDescription: SOT363, SC70-6, 0.65mm Pitch; 6 Pin, 1.25mm W X 2.00mm L X 1.10mm H body, IPC Medium Density; Manufacturer Part Number: 2N7002DW; Pin Count: 6; Case: SOT363; Mounted: Yes; Socket: No; SMD: Yes; Sense: No; ComponentHeight: 1.1mm; HelpURL: \\cern.ch\dfs\Applications\Altium\Datasheets\2N7002DW.pdf; Author: CERN DEM BC; CreateDate: 25.11.2020; LatestRevisionDate: 25.11.2020
TP3-TP6 = SMD_PAD_1.27X1.27MM: as TP204 on sheet FMC_AWG_DAC_PSU_LDO; Part Number: SMD_PAD_1.27X1.27MM; Component Type: Standard (No BOM); Pin Count: 1; Family: Test Point; Socket: No; SMD: Yes; Sense: No; Status: None; ComponentHeight: 0mm; HelpURL: Undefined; Author: CERN DEM JLC; CreateDate: 12.01.2008; LatestRevisionDate: 12.01.2008; PackageDescription: 1.27mm x 1.27mm PCB Copper Area (SMD Test Point)